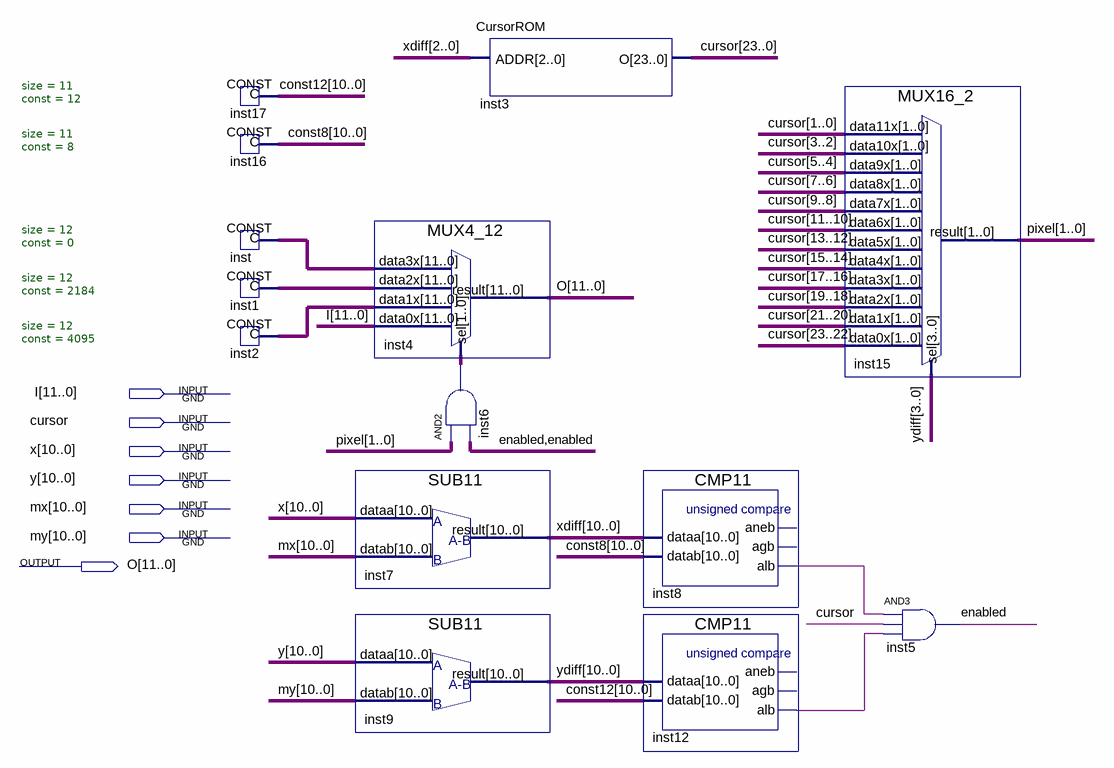
[diagram p0: schematic sheet]
// Quartus schematic BugInserter.bdf as structural Verilog: 14 symbols, 7 pins
module BugInserter (
  input  [11:0] I,
  input  cursor,
  input  [10:0] x,
  input  [10:0] y,
  input  [10:0] mx,
  input  [10:0] my,
  output [11:0] O
);

  wire enabled, inst8_alb, inst12_alb;
  wire [1:0] inst6_out, pixel;
  wire [10:0] const8, const12, xdiff, ydiff;
  wire [11:0] inst1_data, inst2_data, inst_data;
  wire [23:0] cursor_bus;

  CONST #(.size(11), .\const (12)) inst17 (.data(const12));
  CONST #(.size(11), .\const (8)) inst16 (.data(const8));
  CONST #(.size(12), .\const (0)) inst (.data(inst_data));
  CONST #(.size(12), .\const (2184)) inst1 (.data(inst1_data));
  CONST #(.size(12), .\const (4095)) inst2 (.data(inst2_data));
  MUX4_12 inst4 (.data3x(inst_data), .data2x(inst1_data), .data1x(inst2_data), .data0x(I), .sel(inst6_out), .result(O));
  SUB11 inst7 (.dataa(x), .datab(mx), .result(xdiff));
  SUB11 inst9 (.dataa(y), .datab(my), .result(ydiff));
  CursorROM inst3 (.ADDR(xdiff[2:0]), .O(cursor_bus));
  assign inst6_out = pixel & {2{enabled}};  // AND2 inst6, 2 bits wide
  CMP11 inst8 (.dataa(xdiff), .datab(const8), .alb(inst8_alb));  // open: aneb, agb
  CMP11 inst12 (.dataa(ydiff), .datab(const12), .alb(inst12_alb));  // open: aneb, agb
  MUX16_2 inst15 (
    .data11x(cursor_bus[1:0]), .data10x(cursor_bus[3:2]), .data9x(cursor_bus[5:4]), .data8x(cursor_bus[7:6]),
    .data7x(cursor_bus[9:8]), .data6x(cursor_bus[11:10]), .data5x(cursor_bus[13:12]),
    .data4x(cursor_bus[15:14]), .data3x(cursor_bus[17:16]), .data2x(cursor_bus[19:18]),
    .data1x(cursor_bus[21:20]), .data0x(cursor_bus[23:22]), .sel(ydiff[3:0]), .result(pixel));
  and inst5 (enabled, inst8_alb, cursor, inst12_alb);
endmodule
